# Altium schematic sheet DCDC_35V.SchDoc
size 420 x 297 mm; SheetNumber: 4; SheetTotal: 5
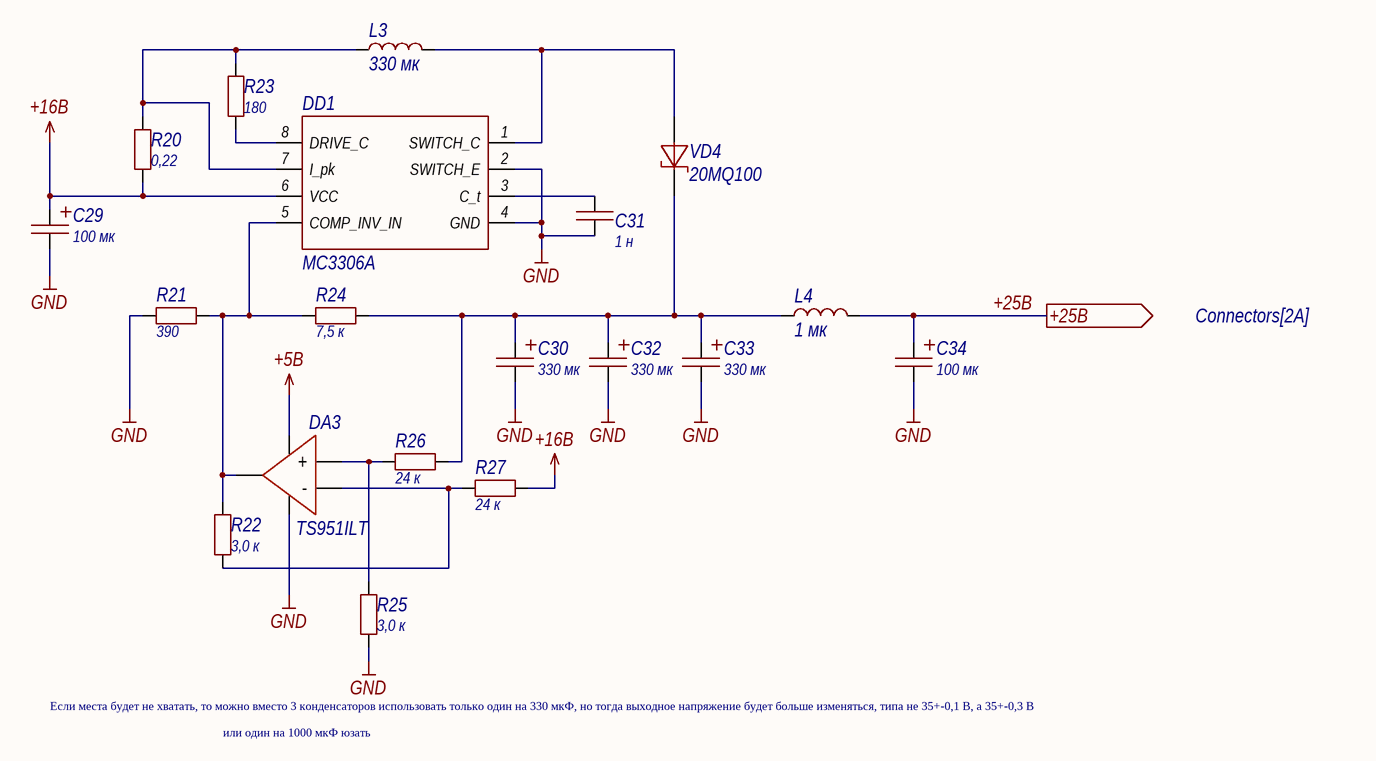
[diagram p0: DCDC_35V.SchDoc]

## Parts
C29  value 100 мк  [ECAP_SMD_6,6x6,6]  (hidden comment: Capacitor)
C30  value 330 мк  [ECAP_SMD_10,3x10,3]  (hidden comment: Capacitor)
C31  value 1 н  [0603C]  (hidden comment: Capacitor)
C32  value 330 мк  [ECAP_SMD_10,3x10,3]  (hidden comment: Capacitor)
C33  value 330 мк  [ECAP_SMD_10,3x10,3]  (hidden comment: Capacitor)
C34  value 100 мк  [ECAP_SMD_6,6x6,6]  (hidden comment: Capacitor)
DA3  TS951ILT  [SOt23-5]
DD1  MC3306A  [SOIC-8]
L3  value 330 мк  [12.8x12.8]  (hidden comment: CDSPRH127-331M)
L4  value 1 мк  [4.5x4_wired]  (hidden comment: CDSP43-1R0M)
R20  value 0,22  [2512R]  (hidden comment: Resistor)
R21  value 390  [0603R]  (hidden comment: Resistor)
R22  value 3,0 к  [0603R]  (hidden comment: Resistor)
R23  value 180  [0603R]  (hidden comment: Resistor)
R24  value 7,5 к  [0603R]  (hidden comment: Resistor)
R25  value 3,0 к  [0603R]  (hidden comment: Resistor)
R26  value 24 к  [0603R]  (hidden comment: Resistor)
R27  value 24 к  [0603R]  (hidden comment: Resistor)
VD4  20MQ100  [SMA]

## Ports
+25В (out, see Connectors[2A])

## Nets
+5В: DA3.5(VCC)
+16В: C29.1 DD1.6(VCC) R20.2 R27.1
GND: C29.2 C30.2 C31.1 C32.2 C33.2 C34.2 DA3.2(GND) DD1.2(SWITCH_E) DD1.4(GND) R21.1 R25.2
+25В: C34.1 L4.2 ; port +25В
NetC30_1: C30.1 C32.1 C33.1 L4.1 R24.2 R26.1 VD4.2
NetC31_2: C31.2 DD1.3(C_t)
NetDA3_1: DA3.1 DD1.5(COMP_INV_IN) R21.2 R22.1 R24.1
NetDA3_3: DA3.3(+) R25.1 R26.2
NetDA3_4: DA3.4(-) R22.2 R27.2
NetDD1_1: DD1.1(SWITCH_C) L3.2 VD4.1
NetDD1_7: DD1.7(I_pk) L3.1 R20.1 R23.2
NetDD1_8: DD1.8(DRIVE_C) R23.1

## Notes on the sheet
- Если места будет не хватать, то можно вместо 3 конденсаторов использовать только один на 330 мкФ, но тогда выходное напряжение будет больше изменяться, типа не 35+-0,1 В, а 35+-0,3 В
- или один на 1000 мкФ юзать
- Перв. примен.
- Справ. №
- Подп. и дата
- Инв. № дубл.
- Взам. инв. №
- Инв. № подл.
- Изм.
- Лист
- № докум.
- Подп.
- Дата
- Копировал
- Формат А3

## Library data of the parts
C29 C34 = JCK1V101: Конденсатор алюминиевый электролитический 100мкФ 35В 20% SMD 6,6x6,6 мм; Tolerance: 20; Voltage (V): 35; Type: SMD Aluminum; Capacity (uF): 100; Part Number: JCK1V101
C30 C32 C33 = JCK1V331: Конденсатор алюминиевый электролитический 1000мкФ 25В 20% Low ESR 1100мА SMD12.5x13.5мм; Tolerance: 20; Voltage (V): 35; Type: SMD Aluminum; Capacity (uF): 330; Part Number: JCK1V331
C31 = Capacitor_1n_10_50V_X7R_0603C: Конденсатор; Library Path2: Schematic\Capacitor.SchLib; Tolerance: 0,1; Voltage (V): 50; Dielectric: X7R; Capacity (nF): 1; Part Number: Capacitor_1n_10_50V_X7R_0603C
DA3 = TS951ILT: Операционный усилитель Rail-to-Rail, 1-канальный; Part Number: TS951ILT
DD1 = MC3306A: DC-DC понижающий/повышающий преобразователь, вход: 3 - 40 В, выход: 1,25 - 40 В 1,5 А; Part Number: MC3306A
L3 = CDSPRH127-331M: Индуктивность на 330 мкГн, номинальный ток 1,79 A; Inductance (μH): 330; Current (A): 1,79; Part Number: CDSPRH127-331M
L4 = CDSP43-1R0M: Индуктивность на 1 мкГн, номинальный ток 4,3 A; Inductance (μH): 1; Current (A): 4,3; Part Number: CDSP43-1R0M
R20 = Resistor_0.22_1_2512: Резистор номиналом 0,22 Ом и точностью 1%; Power: *; Part Number: Resistor_0.22_1_2512; Tolerance: 1%
R21 = Resistor_390_1_0603: Резистор номиналом 390 Ом 1%; Power: *; Part Number: Resistor_390_1_0603; Tolerance: 1%
R22 R25 = Resistor_3.0k_1_0603: Резистор номиналом 3,0 кОм и точностью 1%; Power: *; Part Number: Resistor_3.0k_1_0603; Tolerance: 1%
R23 = Resistor_180_1_0603: Резистор номиналом 180 Ом и точностью 1%; Power: *; Part Number: Resistor_180_1_0603; Tolerance: 1%
R24 = Resistor_7.5k_1_0603: Резистор номиналом 7,5 кОм 1%; Power: *; Part Number: Resistor_7.5k_1_0603; Tolerance: 1%
R26 R27 = Resistor_24k_1_0603: Резистор номиналом 24 кОм и точностью 1%; Power: *; Part Number: Resistor_24k_1_0603; Tolerance: 1%
VD4 = 20MQ100: Диод шоттки на 100 В, ном. ток 2 А; Voltage nominal (V): 100; Current (A): 2; Part Number: 20MQ100